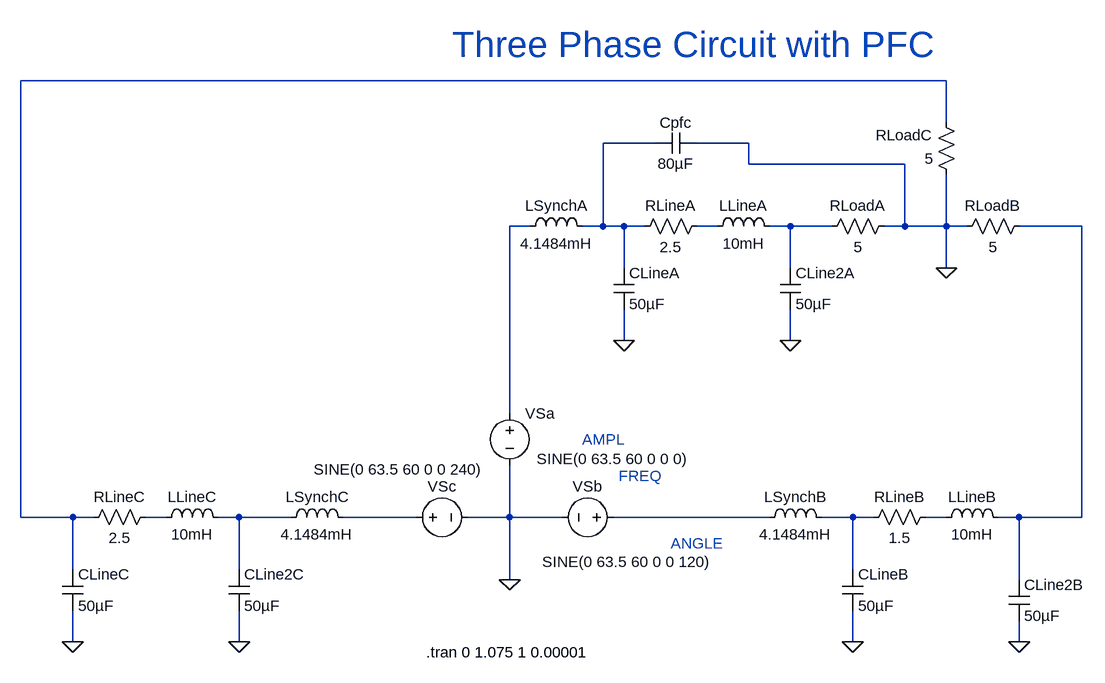
[diagram p0: schematic Draft1.asc]
Draft1.asc, the LTspice schematic file:
Version 4
SHEET 1 904 896
WIRE -576 0 -2000 0
WIRE -576 64 -576 0
WIRE -1024 96 -1104 96
WIRE -880 96 -960 96
WIRE -880 128 -880 96
WIRE -640 128 -880 128
WIRE -1216 224 -1248 224
WIRE -1104 224 -1104 96
WIRE -1104 224 -1136 224
WIRE -1072 224 -1104 224
WIRE -1040 224 -1072 224
WIRE -928 224 -960 224
WIRE -816 224 -848 224
WIRE -752 224 -816 224
WIRE -640 224 -640 128
WIRE -640 224 -672 224
WIRE -576 224 -576 144
WIRE -576 224 -640 224
WIRE -544 224 -576 224
WIRE -368 224 -464 224
WIRE -1072 288 -1072 224
WIRE -816 288 -816 224
WIRE -576 288 -576 224
WIRE -1072 400 -1072 352
WIRE -816 400 -816 352
WIRE -1248 512 -1248 224
WIRE -2000 672 -2000 0
WIRE -1920 672 -2000 672
WIRE -1888 672 -1920 672
WIRE -1776 672 -1808 672
WIRE -1664 672 -1696 672
WIRE -1584 672 -1664 672
WIRE -1392 672 -1504 672
WIRE -1248 672 -1248 592
WIRE -1248 672 -1312 672
WIRE -1168 672 -1248 672
WIRE -848 672 -1088 672
WIRE -720 672 -768 672
WIRE -688 672 -720 672
WIRE -576 672 -608 672
WIRE -464 672 -496 672
WIRE -368 672 -368 224
WIRE -368 672 -464 672
WIRE -1920 752 -1920 672
WIRE -1664 752 -1664 672
WIRE -720 752 -720 672
WIRE -1248 768 -1248 672
WIRE -464 768 -464 672
WIRE -1920 864 -1920 816
WIRE -1664 864 -1664 816
WIRE -720 864 -720 816
WIRE -464 864 -464 832
FLAG -1248 768 0
FLAG -576 288 0
FLAG -1664 864 0
FLAG -1920 864 0
FLAG -816 400 0
FLAG -1072 400 0
FLAG -464 864 0
FLAG -720 864 0
SYMBOL voltage -1248 496 R0
WINDOW 3 42 86 Left 2
SYMATTR Value SINE(0 63.5 60 0 0 0)
SYMATTR InstName VSa
SYMBOL voltage -1072 672 R90
WINDOW 0 -32 56 VBottom 2
WINDOW 3 53 -5 VTop 2
SYMATTR InstName VSb
SYMATTR Value SINE(0 63.5 60 0 0 120)
SYMBOL voltage -1408 672 R270
WINDOW 0 32 56 VTop 2
WINDOW 3 89 -11 VBottom 2
SYMATTR InstName VSc
SYMATTR Value SINE(0 63.5 60 0 0 240)
SYMBOL res -768 240 R270
WINDOW 0 32 56 VTop 2
WINDOW 3 0 56 VBottom 2
SYMATTR InstName RLoadA
SYMATTR Value 5
SYMBOL res -560 240 R270
WINDOW 0 32 56 VTop 2
WINDOW 3 0 56 VBottom 2
SYMATTR InstName RLoadB
SYMATTR Value 5
SYMBOL res -560 160 R180
WINDOW 0 36 76 Left 2
WINDOW 3 36 40 Left 2
SYMATTR InstName RLoadC
SYMATTR Value 5
SYMBOL ind -1232 240 R270
WINDOW 0 32 56 VTop 2
WINDOW 3 5 56 VBottom 2
SYMATTR InstName LSynchA
SYMATTR Value 4.1484mH
SYMBOL ind -864 688 R270
WINDOW 0 32 56 VTop 2
WINDOW 3 5 56 VBottom 2
SYMATTR InstName LSynchB
SYMATTR Value 4.1484mH
SYMBOL ind -1600 688 R270
WINDOW 0 32 56 VTop 2
WINDOW 3 5 56 VBottom 2
SYMATTR InstName LSynchC
SYMATTR Value 4.1484mH
SYMBOL res -1904 688 R270
WINDOW 0 32 56 VTop 2
WINDOW 3 0 56 VBottom 2
SYMATTR InstName RLineC
SYMATTR Value 2.5
SYMBOL ind -1792 688 R270
WINDOW 0 32 56 VTop 2
WINDOW 3 5 56 VBottom 2
SYMATTR InstName LLineC
SYMATTR Value 10mH
SYMBOL res -1056 240 R270
WINDOW 0 32 56 VTop 2
WINDOW 3 0 56 VBottom 2
SYMATTR InstName RLineA
SYMATTR Value 2.5
SYMBOL ind -944 240 R270
WINDOW 0 32 56 VTop 2
WINDOW 3 5 56 VBottom 2
SYMATTR InstName LLineA
SYMATTR Value 10mH
SYMBOL res -704 688 R270
WINDOW 0 32 56 VTop 2
WINDOW 3 0 56 VBottom 2
SYMATTR InstName RLineB
SYMATTR Value 1.5
SYMBOL ind -592 688 R270
WINDOW 0 32 56 VTop 2
WINDOW 3 5 56 VBottom 2
SYMATTR InstName LLineB
SYMATTR Value 10mH
SYMBOL cap -1088 288 R0
SYMATTR InstName CLineA
SYMATTR Value 50µF
SYMBOL cap -832 288 R0
SYMATTR InstName CLine2A
SYMATTR Value 50µF
SYMBOL cap -736 752 R0
SYMATTR InstName CLineB
SYMATTR Value 50µF
SYMBOL cap -480 768 R0
SYMATTR InstName CLine2B
SYMATTR Value 50µF
SYMBOL cap -1936 752 R0
SYMATTR InstName CLineC
SYMATTR Value 50µF
SYMBOL cap -1680 752 R0
SYMATTR InstName CLine2C
SYMATTR Value 50µF
SYMBOL cap -960 80 R90
WINDOW 0 0 32 VBottom 2
WINDOW 3 32 32 VTop 2
SYMATTR InstName Cpfc
SYMATTR Value 80µF
TEXT -1376 880 Left 2 !.tran 0 1.075 1 0.00001
TEXT -1336 -56 Left 5 ;Three Phase Circuit with PFC
TEXT -1136 552 Left 2 ;AMPL
TEXT -1080 608 Left 2 ;FREQ
TEXT -1000 712 Left 2 ;ANGLE

The netlist it stands for:
* Draft1.asc
VSa N003 0 SINE(0 63.5 60 0 0 0)
VSb N010 0 SINE(0 63.5 60 0 0 120)
VSc N009 0 SINE(0 63.5 60 0 0 240)
RLoadA N005 0 5
RLoadB 0 N006 5
RLoadC 0 N001 5
LSynchA N003 N002 4.1484mH
LSynchB N010 N011 4.1484mH
LSynchC N008 N009 4.1484mH
RLineC N001 N007 2.5
LLineC N007 N008 10mH
RLineA N002 N004 2.5
LLineA N004 N005 10mH
RLineB N011 N012 1.5
LLineB N012 N006 10mH
CLineA N002 0 50µF
CLine2A N005 0 50µF
CLineB N011 0 50µF
CLine2B N006 0 50µF
CLineC N001 0 50µF
CLine2C N008 0 50µF
Cpfc 0 N002 80µF
.tran 0 1.075 1 0.00001
* Three Phase Circuit with PFC
* AMPL
* FREQ
* ANGLE
.backanno
.end